# EAGLE board LEDpanelmpsl (EAGLE 6.6.0)
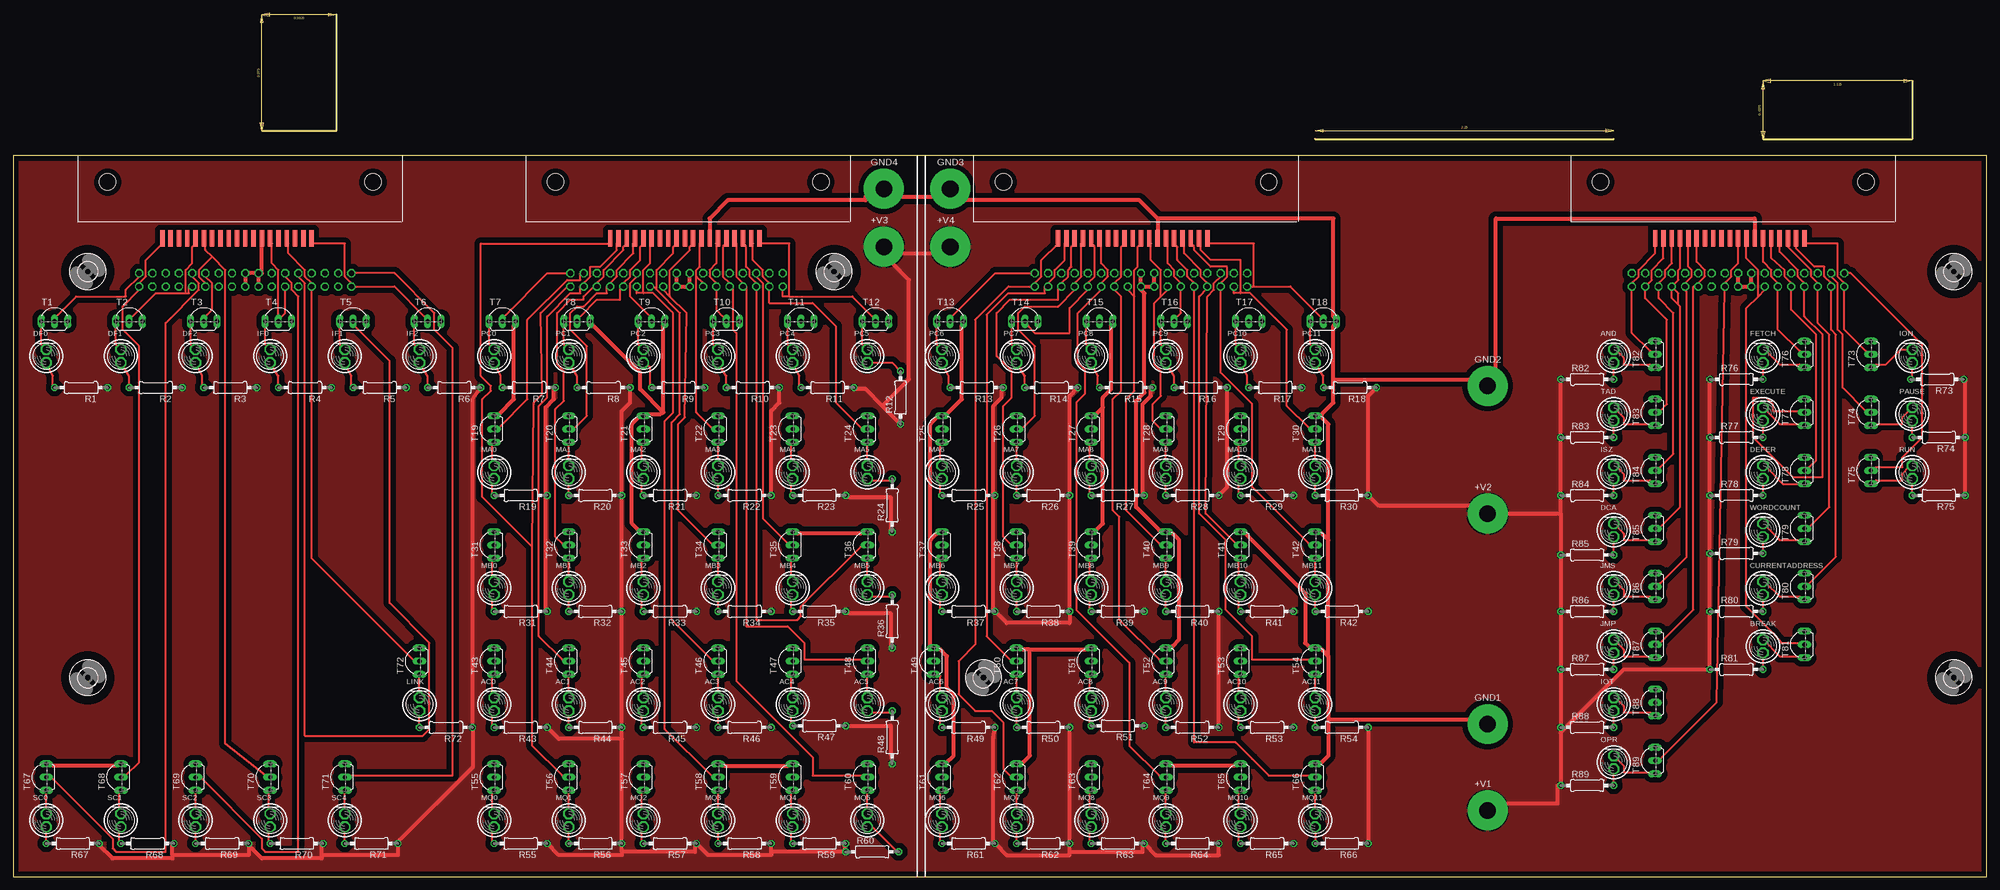
[diagram p2: board, top side]
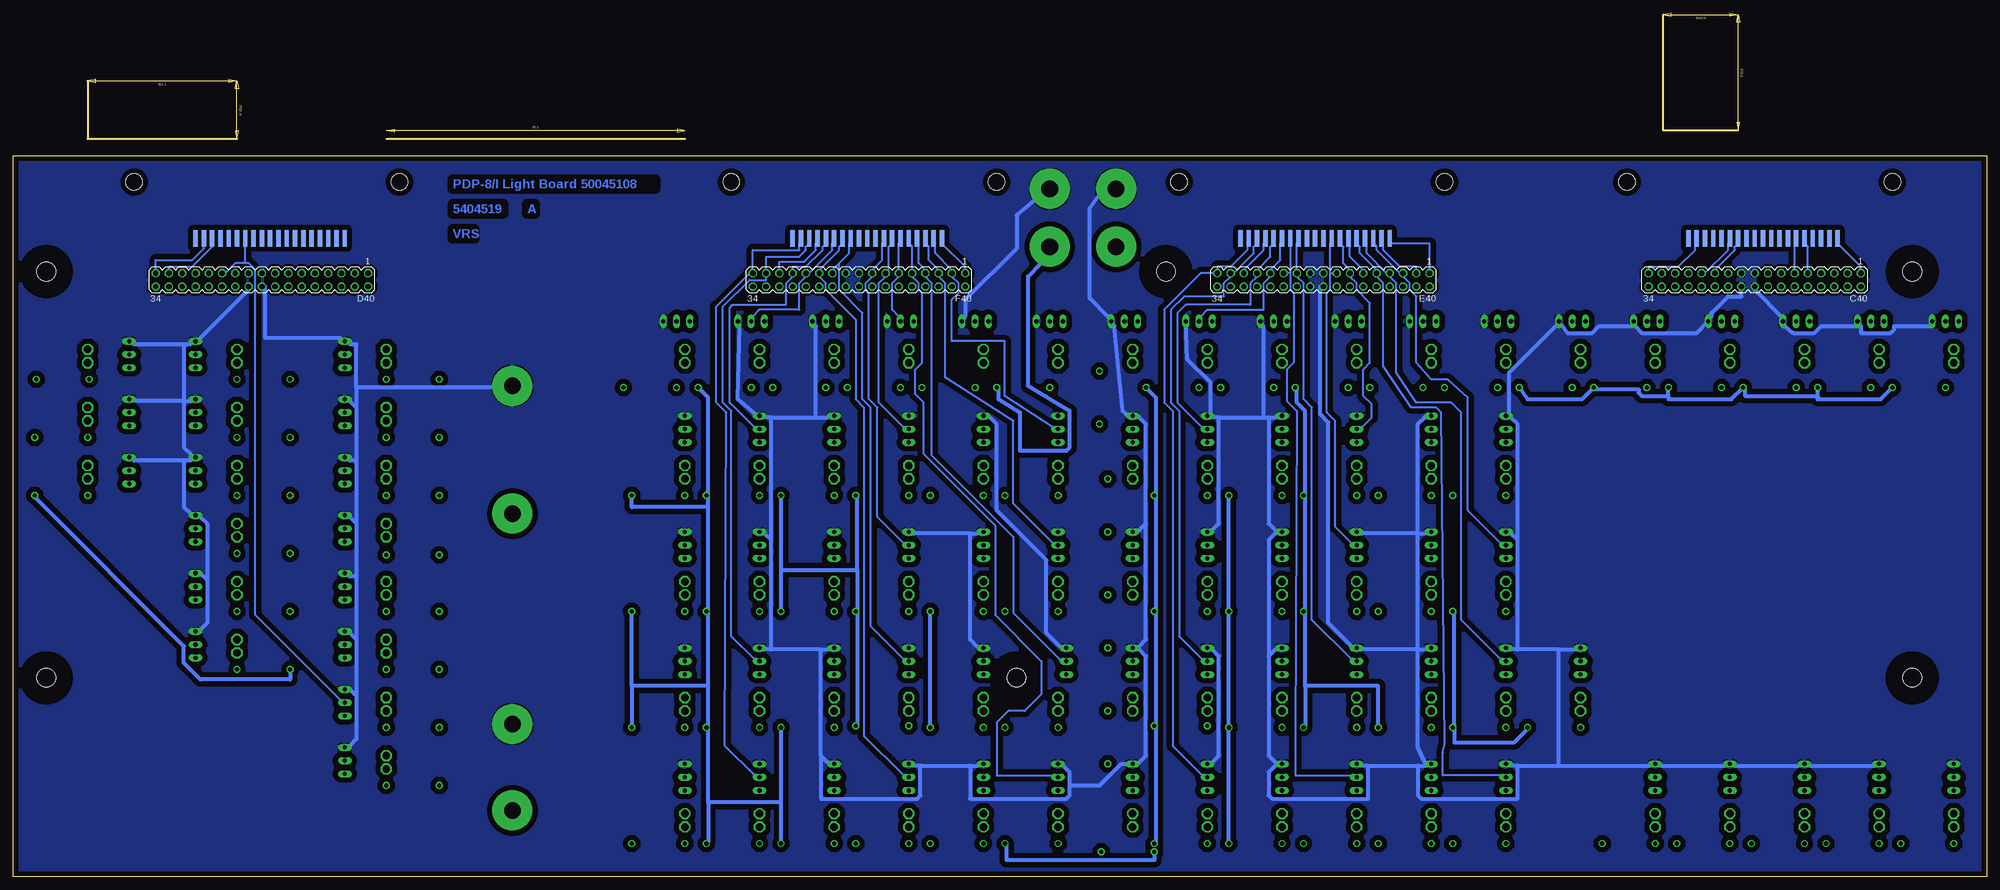
[diagram p3: board, bottom side, seen from below]

Size 377.82 x 165.1 mm. Coordinates in mm from the lower left corner, seen from the top.
Outline: 47.62,142.88 61.91,142.88 61.91,165.1
Outline: 334.96,141.29 363.54,141.29 363.54,152.4
Outline: 249.24,141.29 306.39,141.29
Outline: 377.82,0 377.82,138.11 0,138.11 0,0 377.82,0
Copper layers (1+16): Top 0.035mm / dielectric 1.5mm / Bottom 0.035mm
Design rules "15mils *": minimum track width 15mil, minimum drill 24mil, track to track 15mil, track to pad 10mil, pad to pad 10mil, via to via 10mil, smd to smd 10mil, copper to edge 25mil, drill to drill 10mil, minimum pad ring 10mil, minimum via ring 8mil, stop-mask expansion 0mil, vias tented up to drill 0mil, thermal gap 10mil
Net classes: 1 supply: width 0.762 mm

## Footprints (pad centres in the part's own frame; a part is rotated, then mirrored left to right if it is on the bottom)
SPADELUG = drill 3.175 pad 7.62: 1 0,0
BULB = drill 1.422 octagon: A 0,0; B 0,2.54
MA17-2 = drill 1.016 octagon: 1 -20.32,-1.27; 2 -20.32,1.27; 3 -17.78,-1.27; 4 -17.78,1.27; 5 -15.24,-1.27; 6 -15.24,1.27; 7 -12.7,-1.27; 8 -12.7,1.27; 9 -10.16,-1.27; 10 -10.16,1.27; 11 -7.62,-1.27; 12 -7.62,1.27; 13 -5.08,-1.27; 14 -5.08,1.27; 15 -2.54,-1.27; 16 -2.54,1.27; 17 0,-1.27; 18 0,1.27; 19 2.54,-1.27; 20 2.54,1.27; 21 5.08,-1.27; 22 5.08,1.27; 23 7.62,-1.27; 24 7.62,1.27; 25 10.16,-1.27; 26 10.16,1.27; 27 12.7,-1.27; 28 12.7,1.27; 29 15.24,-1.27; 30 15.24,1.27; 31 17.78,-1.27; 32 17.78,1.27; 33 20.32,-1.27; 34 20.32,1.27
FLEX19 = smd 3.175 x 0.838: 1 0,14.287; 2 0,12.7; 3 0,11.113; 4 0,9.525; 5 0,7.938; 6 0,6.35; 7 0,4.763; 8 0,3.175; 9 0,1.587; 10 0,0; 11 0,-1.587; 12 0,-3.175; 13 0,-4.763; 14 0,-6.35; 15 0,-7.938; 16 0,-9.525; 17 0,-11.113; 18 0,-12.7; 19 0,-14.287
0207/10 = drill 0.813 octagon: 1 -5.08,0; 2 5.08,0
TO92-CBE = drill 0.813 long: B 0,0; C -2.54,0; E 2.54,0
STRAIN-RELIEF = hole 3.175: 7.62,56.515; 7.62,5.715
3,6 = hole 3.6: 0,0

## Placement (x,y rotation side)
+V1  LUG  [SPADELUG]  282.26,12.7 0 top
+V2  LUG  [SPADELUG]  282.26,69.53 0 top
+V3  LUG  [SPADELUG]  166.69,120.65 0 top
+V4  LUG  [SPADELUG]  179.39,120.65 0 top
AC0  [BULB]  92.08,31.75 0 top
AC1  [BULB]  106.36,31.75 0 top
AC2  [BULB]  120.65,31.75 0 top
AC3  [BULB]  134.94,31.75 0 top
AC4  [BULB]  149.22,31.75 0 top
AC5  [BULB]  163.51,31.75 0 top
AC6  [BULB]  177.8,31.75 0 top
AC7  [BULB]  192.09,31.75 0 top
AC8  [BULB]  206.38,31.75 0 top
AC9  [BULB]  220.66,31.75 0 top
AC10  [BULB]  234.95,31.75 0 top
AC11  [BULB]  249.24,31.75 0 top
AND  [BULB]  306.39,98.42 0 top
BREAK  [BULB]  334.96,42.86 0 top
C40  [MA17-2]  44.45,114.3 180 bottom
C40BOT  FLEX19  [FLEX19]  42.86,122.24 90 top
C40TOP  FLEX19  [FLEX19]  42.86,122.24 270 bottom
CURRENTADDRESS  [BULB]  334.96,53.98 0 top
D40  [MA17-2]  330.2,114.3 180 bottom
D40BOT  FLEX19  [FLEX19]  128.59,122.24 90 top
D40TOP  FLEX19  [FLEX19]  128.59,122.24 270 bottom
DCA  [BULB]  306.39,65.09 0 top
DEFER  [BULB]  334.96,76.2 0 top
DF0  [BULB]  6.35,98.42 0 top
DF1  [BULB]  20.64,98.42 0 top
DF2  [BULB]  34.92,98.42 0 top
E40  [MA17-2]  127,114.3 180 bottom
E40BOT  FLEX19  [FLEX19]  214.31,122.24 90 top
E40TOP  FLEX19  [FLEX19]  214.31,122.24 270 bottom
EXECUTE  [BULB]  334.96,87.31 0 top
F40  [MA17-2]  215.9,114.3 180 bottom
F40BOT  FLEX19  [FLEX19]  328.61,122.24 90 top
F40TOP  FLEX19  [FLEX19]  328.61,122.24 270 bottom
FETCH  [BULB]  334.96,98.42 0 top
GND1  LUG  [SPADELUG]  282.26,29.21 0 top
GND2  LUG  [SPADELUG]  282.26,93.98 0 top
GND3  LUG  [SPADELUG]  179.39,131.76 0 top
GND4  LUG  [SPADELUG]  166.69,131.76 0 top
IF0  [BULB]  49.21,98.42 0 top
IF1  [BULB]  63.5,98.42 0 top
IF2  [BULB]  77.79,98.42 0 top
ION  [BULB]  363.54,98.42 0 top
IOT  [BULB]  306.39,31.75 0 top
ISZ  [BULB]  306.39,76.2 0 top
JMP  [BULB]  306.39,42.86 0 top
JMS  [BULB]  306.39,53.98 0 top
LINK  [BULB]  77.79,31.75 0 top
MA0  [BULB]  92.08,76.2 0 top
MA1  [BULB]  106.36,76.2 0 top
MA2  [BULB]  120.65,76.2 0 top
MA3  [BULB]  134.94,76.2 0 top
MA4  [BULB]  149.22,76.2 0 top
MA5  [BULB]  163.51,76.2 0 top
MA6  [BULB]  177.8,76.2 0 top
MA7  [BULB]  192.09,76.2 0 top
MA8  [BULB]  206.38,76.2 0 top
MA9  [BULB]  220.66,76.2 0 top
MA10  [BULB]  234.95,76.2 0 top
MA11  [BULB]  249.24,76.2 0 top
MB0  [BULB]  92.08,53.98 0 top
MB1  [BULB]  106.36,53.98 0 top
MB2  [BULB]  120.65,53.98 0 top
MB3  [BULB]  134.94,53.98 0 top
MB4  [BULB]  149.22,53.98 0 top
MB5  [BULB]  163.51,53.98 0 top
MB6  [BULB]  177.8,53.98 0 top
MB7  [BULB]  192.09,53.98 0 top
MB8  [BULB]  206.38,53.98 0 top
MB9  [BULB]  220.66,53.98 0 top
MB10  [BULB]  234.95,53.98 0 top
MB11  [BULB]  249.24,53.98 0 top
MQ0  [BULB]  92.08,9.53 0 top
MQ1  [BULB]  106.36,9.53 0 top
MQ2  [BULB]  120.65,9.53 0 top
MQ3  [BULB]  134.94,9.53 0 top
MQ4  [BULB]  149.22,9.53 0 top
MQ5  [BULB]  163.51,9.53 0 top
MQ6  [BULB]  177.8,9.53 0 top
MQ7  [BULB]  192.09,9.53 0 top
MQ8  [BULB]  206.38,9.53 0 top
MQ9  [BULB]  220.66,9.53 0 top
MQ10  [BULB]  234.95,9.53 0 top
MQ11  [BULB]  249.24,9.53 0 top
OPR  [BULB]  306.39,20.64 0 top
PAUSE  [BULB]  363.54,87.31 0 top
PC0  [BULB]  92.08,98.42 0 top
PC1  [BULB]  106.36,98.42 0 top
PC2  [BULB]  120.65,98.42 0 top
PC3  [BULB]  134.94,98.42 0 top
PC4  [BULB]  149.22,98.42 0 top
PC5  [BULB]  163.51,98.42 0 top
PC6  [BULB]  177.8,98.42 0 top
PC7  [BULB]  192.09,98.42 0 top
PC8  [BULB]  206.38,98.42 0 top
PC9  [BULB]  220.66,98.42 0 top
PC10  [BULB]  234.95,98.42 0 top
PC11  [BULB]  249.24,98.42 0 top
R1  1.5K  [0207/10]  13.02,93.66 180 top
R2  1.5K  [0207/10]  27.3,93.66 180 top
R3  1.5K  [0207/10]  41.59,93.66 180 top
R4  1.5K  [0207/10]  55.88,93.66 180 top
R5  1.5K  [0207/10]  70.17,93.66 180 top
R6  1.5K  [0207/10]  84.45,93.66 180 top
R7  1.5K  [0207/10]  98.74,93.66 180 top
R8  1.5K  [0207/10]  113.03,93.66 180 top
R9  1.5K  [0207/10]  127.32,93.66 180 top
R10  1.5K  [0207/10]  141.6,93.66 180 top
R11  1.5K  [0207/10]  155.89,93.66 180 top
R12  1.5K  [0207/10]  169.86,91.76 90 top
R13  1.5K  [0207/10]  184.47,93.66 180 top
R14  1.5K  [0207/10]  198.75,93.66 180 top
R15  1.5K  [0207/10]  213.04,93.66 180 top
R16  1.5K  [0207/10]  227.33,93.66 180 top
R17  1.5K  [0207/10]  241.62,93.66 180 top
R18  1.5K  [0207/10]  255.91,93.66 180 top
R19  1.5K  [0207/10]  97.16,73.03 180 top
R20  1.5K  [0207/10]  111.44,73.03 180 top
R21  1.5K  [0207/10]  125.73,73.03 180 top
R22  1.5K  [0207/10]  140.02,73.03 180 top
R23  1.5K  [0207/10]  154.31,73.03 180 top
R24  1.5K  [0207/10]  168.28,71.12 90 top
R25  1.5K  [0207/10]  182.88,73.03 180 top
R26  1.5K  [0207/10]  197.17,73.03 180 top
R27  1.5K  [0207/10]  211.46,73.03 180 top
R28  1.5K  [0207/10]  225.74,73.03 180 top
R29  1.5K  [0207/10]  240.03,73.03 180 top
R30  1.5K  [0207/10]  254.32,73.03 180 top
R31  1.5K  [0207/10]  97.16,50.8 180 top
R32  1.5K  [0207/10]  111.44,50.8 180 top
R33  1.5K  [0207/10]  125.73,50.8 180 top
R34  1.5K  [0207/10]  140.02,50.8 180 top
R35  1.5K  [0207/10]  154.31,50.8 180 top
R36  1.5K  [0207/10]  168.28,48.9 90 top
R37  1.5K  [0207/10]  182.88,50.8 180 top
R38  1.5K  [0207/10]  197.17,50.8 180 top
R39  1.5K  [0207/10]  211.46,50.8 180 top
R40  1.5K  [0207/10]  225.74,50.8 180 top
R41  1.5K  [0207/10]  240.03,50.8 180 top
R42  1.5K  [0207/10]  254.32,50.8 180 top
R43  1.5K  [0207/10]  97.16,28.57 180 top
R44  1.5K  [0207/10]  111.44,28.57 180 top
R45  1.5K  [0207/10]  125.73,28.57 180 top
R46  1.5K  [0207/10]  140.02,28.57 180 top
R47  1.5K  [0207/10]  154.31,28.89 180 top
R48  1.5K  [0207/10]  168.28,26.67 90 top
R49  1.5K  [0207/10]  182.88,28.57 180 top
R50  1.5K  [0207/10]  197.17,28.57 180 top
R51  1.5K  [0207/10]  211.46,28.89 180 top
R52  1.5K  [0207/10]  225.74,28.57 180 top
R53  1.5K  [0207/10]  240.03,28.57 180 top
R54  1.5K  [0207/10]  254.32,28.57 180 top
R55  1.5K  [0207/10]  97.16,6.35 180 top
R56  1.5K  [0207/10]  111.44,6.35 180 top
R57  1.5K  [0207/10]  125.73,6.35 180 top
R58  1.5K  [0207/10]  140.02,6.35 180 top
R59  1.5K  [0207/10]  154.31,6.35 180 top
R60  1.5K  [0207/10]  164.47,4.76 0 top
R61  1.5K  [0207/10]  182.88,6.35 180 top
R62  1.5K  [0207/10]  197.17,6.35 180 top
R63  1.5K  [0207/10]  211.46,6.35 180 top
R64  1.5K  [0207/10]  225.74,6.35 180 top
R65  1.5K  [0207/10]  240.03,6.35 180 top
R66  1.5K  [0207/10]  254.32,6.35 180 top
R67  1.5K  [0207/10]  11.43,6.35 180 top
R68  1.5K  [0207/10]  25.72,6.35 180 top
R69  1.5K  [0207/10]  40.01,6.35 180 top
R70  1.5K  [0207/10]  54.29,6.35 180 top
R71  1.5K  [0207/10]  68.58,6.35 180 top
R72  1.5K  [0207/10]  82.87,28.57 180 top
R73  1.5K  [0207/10]  368.3,95.25 180 top
R74  1.5K  [0207/10]  368.62,84.14 180 top
R75  1.5K  [0207/10]  368.62,73.03 180 top
R76  1.5K  [0207/10]  329.88,95.25 0 top
R77  1.5K  [0207/10]  329.88,84.14 0 top
R78  1.5K  [0207/10]  329.88,73.03 0 top
R79  1.5K  [0207/10]  329.88,61.91 0 top
R80  1.5K  [0207/10]  329.88,50.8 0 top
R81  1.5K  [0207/10]  329.88,39.69 0 top
R82  1.5K  [0207/10]  301.31,95.25 0 top
R83  1.5K  [0207/10]  301.31,84.14 0 top
R84  1.5K  [0207/10]  301.31,73.03 0 top
R85  1.5K  [0207/10]  301.31,61.59 0 top
R86  1.5K  [0207/10]  301.31,50.8 0 top
R87  1.5K  [0207/10]  301.31,39.69 0 top
R88  1.5K  [0207/10]  301.31,28.57 0 top
R89  1.5K  [0207/10]  301.31,17.46 0 top
RUN  [BULB]  363.54,76.2 0 top
SC0  [BULB]  6.35,9.53 0 top
SC1  [BULB]  20.64,9.53 0 top
SC2  [BULB]  34.92,9.53 0 top
SC3  [BULB]  49.21,9.53 0 top
SC4  [BULB]  63.5,9.53 0 top
T1  [TO92-CBE]  7.94,106.36 0 top
T2  [TO92-CBE]  22.23,106.36 0 top
T3  [TO92-CBE]  36.51,106.36 0 top
T4  [TO92-CBE]  50.8,106.36 0 top
T5  [TO92-CBE]  65.09,106.36 0 top
T6  [TO92-CBE]  79.38,106.36 0 top
T7  [TO92-CBE]  93.66,106.36 0 top
T8  [TO92-CBE]  107.95,106.36 0 top
T9  [TO92-CBE]  122.24,106.36 0 top
T10  [TO92-CBE]  136.53,106.36 0 top
T11  [TO92-CBE]  150.81,106.36 0 top
T12  [TO92-CBE]  165.1,106.36 0 top
T13  [TO92-CBE]  179.39,106.36 0 top
T14  [TO92-CBE]  193.68,106.36 0 top
T15  [TO92-CBE]  207.96,106.36 0 top
T16  [TO92-CBE]  222.25,106.36 0 top
T17  [TO92-CBE]  236.54,106.36 0 top
T18  [TO92-CBE]  250.82,106.36 0 top
T19  [TO92-CBE]  92.08,85.72 90 top
T20  [TO92-CBE]  106.36,85.72 90 top
T21  [TO92-CBE]  120.65,85.72 90 top
T22  [TO92-CBE]  134.94,85.72 90 top
T23  [TO92-CBE]  149.22,85.72 90 top
T24  [TO92-CBE]  163.51,85.72 90 top
T25  [TO92-CBE]  177.8,85.72 90 top
T26  [TO92-CBE]  192.09,85.72 90 top
T27  [TO92-CBE]  206.38,85.72 90 top
T28  [TO92-CBE]  220.66,85.72 90 top
T29  [TO92-CBE]  234.95,85.72 90 top
T30  [TO92-CBE]  249.24,85.72 90 top
T31  [TO92-CBE]  92.08,63.5 90 top
T32  [TO92-CBE]  106.36,63.5 90 top
T33  [TO92-CBE]  120.65,63.5 90 top
T34  [TO92-CBE]  134.94,63.5 90 top
T35  [TO92-CBE]  149.22,63.5 90 top
T36  [TO92-CBE]  163.51,63.5 90 top
T37  [TO92-CBE]  177.8,63.5 90 top
T38  [TO92-CBE]  192.09,63.5 90 top
T39  [TO92-CBE]  206.38,63.5 90 top
T40  [TO92-CBE]  220.66,63.5 90 top
T41  [TO92-CBE]  234.95,63.5 90 top
T42  [TO92-CBE]  249.24,63.5 90 top
T43  [TO92-CBE]  92.08,41.27 90 top
T44  [TO92-CBE]  106.36,41.27 90 top
T45  [TO92-CBE]  120.65,41.27 90 top
T46  [TO92-CBE]  134.94,41.27 90 top
T47  [TO92-CBE]  149.22,41.27 90 top
T48  [TO92-CBE]  163.51,41.27 90 top
T49  [TO92-CBE]  176.21,41.27 90 top
T50  [TO92-CBE]  192.09,41.27 90 top
T51  [TO92-CBE]  206.38,41.27 90 top
T52  [TO92-CBE]  220.66,41.27 90 top
T53  [TO92-CBE]  234.95,41.27 90 top
T54  [TO92-CBE]  249.24,41.27 90 top
T55  [TO92-CBE]  92.08,19.05 90 top
T56  [TO92-CBE]  106.36,19.05 90 top
T57  [TO92-CBE]  120.65,19.05 90 top
T58  [TO92-CBE]  134.94,19.05 90 top
T59  [TO92-CBE]  149.22,19.05 90 top
T60  [TO92-CBE]  163.51,19.05 90 top
T61  [TO92-CBE]  177.8,19.05 90 top
T62  [TO92-CBE]  192.09,19.05 90 top
T63  [TO92-CBE]  206.38,19.05 90 top
T64  [TO92-CBE]  220.66,19.05 90 top
T65  [TO92-CBE]  234.95,19.05 90 top
T66  [TO92-CBE]  249.24,19.05 90 top
T67  [TO92-CBE]  6.35,19.05 90 top
T68  [TO92-CBE]  20.64,19.05 90 top
T69  [TO92-CBE]  34.92,19.05 90 top
T70  [TO92-CBE]  49.21,19.05 90 top
T71  [TO92-CBE]  63.5,19.05 90 top
T72  [TO92-CBE]  77.79,41.27 90 top
T73  [TO92-CBE]  355.6,100.01 90 top
T74  [TO92-CBE]  355.6,88.9 90 top
T75  [TO92-CBE]  355.6,77.79 90 top
T76  [TO92-CBE]  342.9,100.01 90 top
T77  [TO92-CBE]  342.9,88.9 90 top
T78  [TO92-CBE]  342.9,77.79 90 top
T79  [TO92-CBE]  342.9,66.67 90 top
T80  [TO92-CBE]  342.9,55.56 90 top
T81  [TO92-CBE]  342.9,44.45 90 top
T82  [TO92-CBE]  314.32,100.01 90 top
T83  [TO92-CBE]  314.32,88.9 90 top
T84  [TO92-CBE]  314.32,77.79 90 top
T85  [TO92-CBE]  314.32,66.67 90 top
T86  [TO92-CBE]  314.32,55.56 90 top
T87  [TO92-CBE]  314.32,44.45 90 top
T88  [TO92-CBE]  314.32,33.34 90 top
T89  [TO92-CBE]  314.32,22.23 90 top
TAD  [BULB]  306.39,87.31 0 top
U$1  [STRAIN-RELIEF]  74.61,125.41 90 top
U$2  [STRAIN-RELIEF]  160.34,125.41 90 top
U$3  [STRAIN-RELIEF]  246.06,125.41 90 top
U$4  [STRAIN-RELIEF]  360.36,125.41 90 top
U$5  [3,6]  371.48,115.89 0 top
U$6  [3,6]  371.48,38.1 0 top
U$7  [3,6]  185.74,38.1 0 top
U$8  [3,6]  14.29,38.1 0 top
U$9  [3,6]  14.29,115.89 0 top
U$11  [3,6]  157.16,115.89 0 top
WORDCOUNT  [BULB]  334.96,65.09 0 top

## Tracks (layer width: path | path; a pad name or v marks a point on that pad's centre or on a via)
+15V
  Top 0.762: 30.48,4.13 30.48,6.03 R68.1 | 30.48,4.13 30.48,3.49 19.05,3.49 16.51,6.03 R67.1 | 45.09,6.03 47.62,3.49 59.05,3.49 59.05,4.13 | 59.05,4.13 59.05,6.03 R70.1 | 30.48,4.13 45.09,4.13 45.09,6.03 | 45.09,6.03 R69.1 | R31.1 101.92,51.12 101.92,72.71 R19.1 101.92,73.34 101.92,89.85 103.5,91.44 103.5,93.34 R7.1 | 59.05,4.13 73.66,4.13 R71.1 73.66,6.67 87.95,20.95 R72.1 87.95,91.44 R6.1 | R12.1 166.37,90.17 | 166.37,90.17 163.19,93.34 161.29,93.34 R11.1 | R23.1 159.7,72.71 167.96,72.71 167.96,66.36 R24.1 | R35.1 159.7,50.48 167.96,50.48 167.96,44.13 R36.1 | R47.1 167.96,28.89 167.96,23.5 R48.1 | R55.1 104.46,4.13 116.52,4.13 116.52,4.76 | 116.52,4.76 R56.1 116.52,26.35 | 116.52,26.35 R44.1 R32.1 R20.1 116.52,89.22 118.11,90.81 R8.1 | 159.07,4.76 159.07,6.03 R59.1 | 145.1,4.76 R58.1 | 145.1,4.76 145.1,4.13 133.03,4.13 R57.1 130.49,6.03 130.49,4.76 116.52,4.76 | R22.1 145.1,89.22 146.69,90.81 R10.1 | 159.07,4.76 145.1,4.76 | 159.07,4.76 R60.1 | R43.1 104.46,26.35 116.52,26.35 | R13.1 189.23,93.34 189.23,91.76 187.64,90.17 187.64,73.34 R25.1 187.64,72.71 187.64,51.12 R37.1 190.18,48.58 202.25,48.58 R38.1 R26.1 202.25,92.08 R14.1 | R49.1 187.64,26.67 187.64,6.67 R61.1 190.18,4.13 202.25,4.13 202.25,4.76 | R50.1 R62.1 202.25,4.76 | R54.1 R66.1 | R15.1 217.81,93.34 217.81,92.08 216.22,90.49 216.22,73.34 R27.1 | R64.1 230.82,4.13 218.76,4.13 R63.1 216.22,6.03 216.22,4.76 202.25,4.76 | R52.1 R40.1 | R28.1 232.41,74.61 R16.1 | R75.1 R74.1 373.7,94.93 R73.1 | R76.1 R77.1 R78.1 R79.1 R80.1 R81.1 308.29,39.69 296.23,27.62 | R18.1 259.4,92.08 R30.1 261.3,71.12 278.76,71.12 +V2.1 296.23,69.53 | R82.1 R83.1 R84.1 296.23,69.53
  Top 0.762: 296.23,27.62 R88.1 R87.1 R86.1 R85.1 296.23,69.53 | 296.23,27.62 R89.1 295.59,17.46 295.59,13.97 285.75,13.97 +V1.1 | +V4.1 175.9,119.38 | 166.37,90.17 171.45,95.25 171.45,114.3 168.28,117.47 +V3.1 170.18,119.38 175.58,119.38
  Bottom 0.762: R6.1 87.95,91.44 77.47,91.44 R5.1 74.93,93.34 66.67,93.34 66.67,92.71 66.04,92.08 60.96,92.08 | R1.1 20.32,91.44 32.38,91.44 32.38,92.08 | 32.38,92.08 R2.1 | 60.96,92.08 R4.1 | 60.96,92.08 60.96,91.44 48.9,91.44 R3.1 46.35,93.34 46.35,92.08 32.38,92.08 | R31.1 101.92,50.48 101.92,28.89 R43.1 101.92,28.26 101.92,25.72 90.49,25.72 87.95,28.26 R72.1 | 159.07,28.89 159.07,50.48 R35.1 159.07,51.12 159.07,72.71 R23.1 159.07,73.34 159.07,91.76 R11.1 160.66,93.98 | 130.49,36.51 130.49,50.48 R33.1 130.49,51.12 130.49,72.71 R21.1 130.49,73.34 130.49,89.22 132.08,90.81 132.08,93.34 R9.1 | 130.49,36.51 130.49,28.89 R45.1 | 130.49,36.51 116.52,36.51 R44.1 | R58.1 R46.1 R34.1 R22.1 | 159.07,28.89 159.07,6.67 R59.1 | 159.07,28.89 R47.1 | +V4.1 180.97,117.47 183.51,114.94 183.51,93.98 175.58,89.22 175.58,82.23 176.21,81.6 185.1,81.6 185.1,88.9 189.23,91.44 189.23,93.34 R13.1 | R50.1 R38.1 | 259.4,36.51 R54.1 | 259.4,36.51 R42.1 | 244.79,14.29 244.79,28.26 R53.1 244.79,28.89 244.79,36.51 | 244.79,14.29 244.79,6.67 R65.1 | 244.79,36.51 244.79,50.48 R41.1 244.79,51.12 244.79,70.8 | 244.79,70.8 244.79,72.71 R29.1 244.79,73.34 244.79,91.76 R17.1 | 244.79,36.51 259.4,36.51 | R51.1 216.22,28.89 216.22,50.48 R39.1 216.22,51.12 216.22,58.74 | 216.22,58.74 216.22,72.71 R27.1 | R64.1 230.82,14.29 | 230.82,14.29 R52.1 | R40.1 230.82,58.74 | 230.82,58.74 R28.1 | 230.82,58.74 216.22,58.74 | 230.82,14.29 244.79,14.29 | R81.1 324.8,37.78 341.95,37.78 345.12,40.96 345.12,44.13 373.7,72.71 R75.1 | 244.79,70.8 259.4,70.8 R30.1 | R60.1 159.38,3.17 187.64,3.17 187.64,6.03 | 187.64,6.03 187.64,6.35 | 187.64,6.03 R61.1
  pour Top (isolate 1.016): 0,0 377.82,0 377.82,138.11 0,138.11
AC0
  Bottom 0.381: T43.B 93.03,41.59 100.65,49.21 100.65,88.9 102.55,90.81 109.22,90.81 113.03,96.52 113.03,113.67 114.3,114.94 E40.7 114.94,115.57 118.75,119.38 118.75,121.28 D40TOP.4
AC1
  Top 0.381: T44.B 105.09,41.59 100.65,46.04 100.65,90.17 102.23,91.76 102.23,107.31 106.68,111.76 108.58,111.76 108.58,113.03 E40.4 109.22,113.67 110.49,114.94 110.49,116.84 112.39,116.84 115.57,120.02 115.57,121.28 D40BOT.2
AC2
  Bottom 0.381: D40TOP.12 132.08,121.28 E40.21 132.08,114.94 130.81,113.67 130.81,91.44 129.22,89.85 129.22,49.21 121.6,41.59 T45.B
AC3
  Top 0.381: 123.19,112.39 122.56,113.03 E40.14 | 123.19,112.39 127.64,107.95 127.64,88.58 126.05,87 126.05,49.21 133.67,41.59 T46.B | 123.19,112.39 123.19,116.2 126.36,119.38 126.36,120.65 127,121.28 D40BOT.9
AC4
  Bottom 0.381: D40TOP.17 139.7,121.28 140.34,120.65 140.34,119.38 144.15,115.57 E40.31 144.78,114.94 146.05,113.67 146.05,111.12 153.67,111.12 156.21,108.58 156.21,90.81 154.62,89.22 154.62,46.04 150.18,41.59 T47.B
AC5
  Top 0.381: T48.B 162.24,41.59 151.45,41.59 151.45,44.77 148.27,47.94 140.34,47.94 140.34,113.03 E40.28 139.7,113.67 138.43,114.94 138.43,121.28 D40BOT.16
AC6
  Bottom 0.381: E40TOP.4 204.47,121.28 204.47,117.47 203.2,116.2 F40.7 203.2,114.94 201.93,113.67 201.93,80.64 186.37,65.09 186.37,50.48 177.48,41.59 T49.B
AC7
  Top 0.381: T50.B 190.82,41.59 186.37,46.04 186.37,107.63 190.5,111.76 197.49,111.76 197.49,113.03 F40.4 198.12,113.67 199.39,114.94 199.39,116.2 201.29,118.11 201.29,121.28 E40BOT.2
AC8
  Bottom 0.381: 219.71,117.47 220.98,116.2 F40.21 | 219.71,117.47 217.81,119.38 217.81,121.28 E40TOP.12 | 219.71,117.47 219.71,112.39 215.26,107.95 215.26,91.44 213.68,89.85 213.68,47.94 207.33,41.59 T51.B
AC9
  Top 0.381: T52.B 219.39,41.59 211.77,49.21 211.77,68.9 210.5,70.17 210.5,91.44 212.09,93.03 212.09,111.12 210.82,112.39 F40.14 210.82,113.67 212.09,114.94 212.09,120.65 212.72,121.28 E40BOT.9
AC10
  Bottom 0.381: T53.B 235.9,41.59 240.35,46.04 240.35,89.22 241.94,90.81 241.94,109.22 236.85,114.3 233.68,114.3 F40.31 233.68,118.75 227.33,118.75 226.06,120.02 226.06,120.65 225.43,121.28 E40TOP.17
AC11
  Top 0.381: T54.B 247.97,41.59 237.17,41.59 237.17,46.04 232.09,51.12 232.09,64.45 227.01,69.53 227.01,111.12 228.6,112.71 F40.28 228.6,113.67 227.33,114.94 227.33,116.2 224.16,119.38 224.16,121.28 E40BOT.16
AND
  Top 0.381: T82.B 313.37,100.65 309.88,104.14 D40.2 309.88,113.67 311.15,114.94 311.15,116.2 314.32,119.38 F40BOT.1
BREAK
  Top 0.381: 334.01,111.12 335.28,112.39 D40.22 | 334.01,111.12 331.79,108.9 331.79,51.75 336.87,46.67 338.45,44.77 341.95,44.77 T81.B | 334.01,111.12 334.01,116.2 331.79,118.43 331.79,121.6 F40BOT.12
CA
  Top 0.381: T80.B 343.85,56.2 348.93,61.28 348.93,103.82 347.98,104.78 D40.32 347.98,113.67 346.71,114.94 346.71,116.84 344.81,116.84 341.31,120.33 341.31,121.6 F40BOT.18
DCA
  Top 0.381: 318.77,109.54 317.5,110.81 D40.8 | 318.77,109.54 319.09,109.22 319.09,70.8 315.28,66.99 T85.B | 318.77,109.54 318.77,111.76 D40.8 | D40.8 318.77,114.3 318.77,116.2 319.09,116.52 F40BOT.4
DEFER
  Top 0.381: T78.B 343.85,78.42 345.12,79.69 345.12,103.82 340.36,108.58 D40.26 340.36,113.67 339.09,114.94 339.09,116.2 336.55,118.43 336.55,120.97 336.55,121.28 F40BOT.15
DF0
  Top 0.381: T1.B 8.26,107.31 12.06,111.12 21.59,111.12 21.59,112.39 24.13,114.94 C40.1
  Bottom 0.381: C40TOP.1 28.57,121.28 24.13,116.84 24.13,116.2 C40.1
DF1
  Top 0.381: 33.02,111.76 33.66,111.76 33.66,113.03 C40.10 | 33.02,111.76 27.3,111.76 22.86,107.31 T2.B | 33.02,111.76 33.02,116.2 34.29,117.47 34.29,120.65 34.92,121.28 C40BOT.5
DF2
  Top 0.381: T3.B 36.83,107.31 38.1,108.58 38.1,113.67 36.83,114.94 C40.11
  Bottom 0.381: C40TOP.6 36.83,121.28 36.83,116.2 C40.11
EXECUTE
  Top 0.381: T77.B 341.95,89.22 336.87,89.22 336.87,90.49 335.6,91.76 333.06,91.76 333.06,84.14 340.68,76.52 346.39,76.52 346.39,103.82 342.9,107.31 D40.28 342.9,113.67 341.63,114.94 341.63,116.2 338.14,119.7 338.14,121.6 F40BOT.16
FETCH
  Top 0.381: T76.B 341.95,100.65 337.82,104.78 D40.24 337.82,113.67 336.55,114.94 336.55,116.2 334.96,117.79 334.96,121.6 F40BOT.14
GND
  Top 0.762: D40BOT.13 133.35,126.05 136.84,129.54 163.19,129.54 163.19,130.18 GND4.1 170.18,130.18 175.9,130.18 GND3.1 182.25,129.54 215.58,129.54 219.07,126.05 | T58.E 136.21,21.27 148.27,21.27 T59.E | T35.E 150.18,65.72 162.24,65.72 T36.E | 124.46,88.9 124.46,105.41 T9.E | 124.46,88.9 123.83,88.58 121.6,88.58 T21.E 119.7,87.95 118.43,86.68 118.43,67.63 119.7,66.36 T33.E | 124.46,88.9 120.02,93.34 120.02,96.52 111.12,105.41 T8.E | E40.17 E40.18 E40.20 E40.19 | T67.E 7.62,21.27 19.68,21.27 T68.E | C40.20 C40.19 | C40BOT.13 47.62,115.57 C40.19 | C40.18 C40.17 C40.19 | T19.E 93.03,88.58 95.89,91.44 95.89,105.41 T7.E | D40.17 D40.18 D40.20 D40.19 | T13.E 181.61,105.41 181.61,91.44 178.75,88.58 T25.E 176.85,87.95 175.58,86.68 175.58,64.45 | T61.E 178.75,21.91 180.02,23.18 180.02,34.92 178.75,36.2 178.75,42.23 177.48,43.5 T49.E 175.58,44.13 175.58,64.45 | 175.58,64.45 176.85,65.72 T37.E | 194.63,43.5 205.42,43.5 T51.E | 194.63,43.5 193.36,43.5 T50.E | 194.63,43.5 194.63,23.18 193.36,21.91 T62.E | 208.6,89.85 207.33,88.58 T27.E | 208.6,89.85 208.6,91.76 210.19,93.34 210.19,105.41 T15.E | 208.6,89.85 208.6,67.63 207.33,66.36 T39.E | T64.E 221.93,21.27 234,21.27 T65.E | F40.18 F40.20 F40.19 | F40.18 F40.17 | T52.E 221.93,44.13 223.2,45.4 223.2,64.45 221.93,65.72 T40.E 219.39,66.36 214.95,70.8 214.95,91.12 216.53,92.71 216.53,111.76 215.9,112.39 F40.18 | F40BOT.13 333.38,126.05 283.85,126.05 283.85,97.16 GND2.1 278.76,95.25 252.73,95.25 | 219.07,126.05 E40BOT.13 | 252.73,95.25 252.73,105.41 T18.E 252.73,107.31 252.73,126.05 219.07,126.05 | 252.73,95.25 252.73,90.81 250.51,88.58 T30.E 250.51,87.95 251.78,86.68 251.78,64.45
  Top 0.762: 251.78,42.23 251.78,30.16 | 251.78,30.16 251.78,23.18 250.51,21.91 T66.E | 251.78,42.23 250.51,43.5 T54.E 247.97,44.13 247.33,44.77 247.33,54.29 235.9,65.72 T41.E | 251.78,64.45 250.51,65.72 T42.E | 251.78,42.23 251.78,64.45 | 251.78,30.16 278.76,30.16 GND1.1
  Bottom 0.762: 137.48,42.23 136.21,43.5 T46.E | 137.48,42.23 137.48,23.18 136.21,21.91 T58.E 136.21,21.27 137.48,20 137.48,15.56 136.84,14.92 118.43,14.92 118.43,21.27 | 137.48,42.23 137.48,64.45 136.21,65.72 T34.E 136.21,66.36 137.48,67.63 137.48,87.95 | T47.E 148.27,43.5 147,42.23 147,23.18 148.27,21.91 T59.E | 147,87.95 148.27,87.95 | 147,87.95 138.43,87.95 | 138.43,87.95 136.21,87.95 T22.E | 148.27,87.95 T23.E | 138.43,87.95 138.43,105.41 T10.E | 148.27,87.95 148.59,87.95 148.59,94.61 153.03,99.06 T11.E | 147,87.95 147,67.63 148.27,66.36 T35.E | 160.97,67.63 160.97,86.68 162.24,87.95 T24.E 164.78,88.58 165.42,89.22 167,105.41 T12.E 168.28,107.31 171.77,110.81 171.77,127.95 170.18,130.18 GND4.1 | 160.97,67.63 162.24,66.36 T36.E | 160.97,67.63 160.97,45.4 162.24,44.13 T48.E 162.24,43.5 160.97,42.23 160.97,23.18 162.24,21.91 T60.E 165.74,21.59 169.86,17.46 175.58,17.46 | 108.9,65.72 119.7,65.72 T33.E | 108.9,65.72 107.63,65.72 T32.E | 108.9,65.72 108.9,86.68 107.63,87.95 T20.E | 118.43,21.27 119.7,21.27 T57.E | 118.43,21.27 108.9,21.27 | 108.9,21.27 107.63,21.27 T56.E 107.63,21.91 108.9,24.77 108.9,43.5 | 108.9,43.5 119.7,43.5 T45.E 121.6,44.13 126.05,48.58 126.05,87 127.64,88.58 127.64,113.03 E40.18 | 108.9,43.5 107.63,43.5 T44.E | 108.9,43.5 108.9,65.72 | T68.E 21.59,21.27 33.66,21.27 T69.E 36.2,21.27 48.26,21.27 T70.E 50.16,21.27 62.23,21.27 T71.E 64.77,21.27 81.92,21.27 | 89.85,21.27 81.92,21.27 | 89.85,21.27 91.12,21.27 T55.E | C40.20 46.99,111.12 49.53,111.12 52.7,107.95 52.7,107.31 T4.E 55.56,104.14 66.04,104.14 67.31,105.41 T5.E 67.94,105.41 74.3,105.41 75.56,104.14 80.33,104.14 81.28,105.41 T6.E 82.55,105.41 91.44,96.52 91.44,88.27 T19.E 91.12,87.95 89.85,86.68 89.85,64.45
  Bottom 0.762: T1.E 10.79,105.41 17.78,105.41 17.78,104.78 18.41,104.14 24.13,104.14 24.13,105.41 T2.E 25.4,105.41 31.75,105.41 33.02,104.14 37.15,104.14 38.73,105.41 T3.E 39.37,107.31 44.45,112.39 C40.18 | 89.85,43.5 91.12,43.5 T43.E | 81.92,43.5 89.85,43.5 | 81.92,43.5 79.06,43.5 T72.E | 89.85,64.45 91.12,65.72 T31.E | 89.85,43.5 89.85,64.45 | 81.92,21.27 81.92,43.5 | 108.9,21.27 108.9,15.56 108.27,14.92 89.85,14.92 89.85,21.27 | 312.1,34.61 312.1,26.35 313.37,25.08 T89.E | 312.1,34.61 313.37,35.88 T88.E | 312.1,45.4 313.37,46.67 T87.E | 312.1,45.4 312.1,34.61 | 312.1,57.47 313.37,57.47 T86.E | 312.1,57.47 312.1,45.4 | 312.1,67.63 313.37,68.9 T85.E | 312.1,67.63 312.1,57.47 | 312.1,79.69 313.37,79.69 T84.E | 312.1,79.69 312.1,67.63 | 312.1,89.85 313.37,91.12 T83.E | 312.1,89.85 312.1,79.69 | 312.1,93.66 312.1,89.85 | 312.1,93.66 312.1,101.92 313.37,101.92 T82.E 315.28,103.19 329.56,103.19 329.56,113.03 D40.18 | 345.12,101.92 354.65,101.92 T73.E | 345.12,101.92 343.85,101.92 T76.E 341.95,103.19 332.74,112.39 D40.20 | 340.68,56.83 340.68,48.58 341.95,47.31 T81.E | 340.68,56.83 341.95,58.1 T80.E | 340.68,56.83 340.68,67.63 341.95,68.9 T79.E 343.85,69.53 345.12,70.8 345.12,79.69 | 345.12,79.69 354.65,79.69 T75.E | 345.12,79.69 343.85,79.69 T78.E 343.85,80.96 345.12,82.23 345.12,91.12 | 345.12,91.12 354.65,91.12 T74.E | 345.12,91.12 343.85,91.12 T77.E | 345.12,101.92 345.12,91.12 | T26.E 190.82,87.95 189.55,86.68 189.55,70.17 180.02,60.64 180.02,46.67 177.48,44.13 T49.E | 204.15,21.27 205.42,21.27 T63.E | 204.15,21.27 194.63,21.27 | 194.63,21.27 193.36,21.27 T62.E | 194.63,65.72 205.42,65.72 T39.E | 194.63,65.72 193.36,65.72 T38.E
  Bottom 0.762: 194.63,65.72 194.63,45.4 193.36,44.13 T50.E | 175.58,17.46 175.58,15.56 176.21,14.92 194.63,14.92 194.63,21.27 | 175.58,17.46 175.58,20 176.85,21.27 T61.E | 232.73,87.95 234,87.95 | 232.73,87.95 224.16,87.95 | 224.16,87.95 221.93,87.95 T28.E | 234,87.95 T29.E | 224.16,87.95 224.16,105.41 T16.E | 234,87.95 234.95,87.95 239.08,91.44 238.76,105.41 T17.E | 232.73,43.5 234,43.5 T53.E | 223.2,43.5 232.73,43.5 | 223.2,43.5 221.93,43.5 T52.E | 232.73,64.45 234,65.72 T41.E | 232.73,43.5 232.73,64.45 | 223.2,23.18 221.93,21.91 T64.E | 223.2,23.18 223.2,43.5 | 232.73,64.45 232.73,87.95 | 204.15,21.27 204.15,15.56 204.79,14.92 223.2,14.92 223.2,23.18 | 312.1,93.66 285.12,93.66 GND2.1 | T14.E 195.58,107.31 195.58,110.49 185.74,120.33 185.74,126.68 182.25,129.54 GND3.1
  pour Bottom (isolate 1.016): 0,0 377.82,0 377.82,138.11 0,138.11
IF0
  Top 0.381: C40.24 52.07,112.39 52.07,107.95 51.44,107.31 T4.B 50.8,107.31 50.8,116.2 49.53,117.47 49.53,121.28 C40BOT.14
IF1
  Top 0.381: T5.B 65.41,105.41 72.07,98.74 72.07,52.39 79.69,44.77 79.69,28.26 78.42,26.99 55.88,26.99 55.88,113.67 54.61,114.94 C40.25
  Bottom 0.381: C40TOP.14 49.53,121.28 49.53,120.02 53.98,115.57 C40.25
IF2
  Top 0.381: T6.B 78.74,107.31 73.03,113.03 65.41,113.03 C40.34 64.77,113.67 63.5,114.94 63.5,121.28 57.15,121.28 C40BOT.19
ION
  Top 0.381: T73.B 354.65,100.65 350.52,104.78 D40.34 350.52,113.67 349.25,114.94 349.25,121.28 342.9,121.28 F40BOT.19
IOT
  Bottom 0.381: 332.74,117.47 333.38,117.47 333.38,120.65 F40TOP.13 | 332.74,117.47 331.47,116.2 331.47,50.16 315.28,33.97 T88.B | 332.74,117.47 335.28,117.47 337.19,115.57 D40.23
ISZ
  Top 0.381: F40BOT.3 317.5,117.47 316.23,116.2 316.23,114.94 314.96,113.67 D40.6 314.96,110.81 317.82,107.95 317.82,80.96 315.28,78.42 T84.B
JMP
  Top 0.381: F40BOT.6 322.26,121.6 322.26,117.79 323.85,116.2 323.85,114.94 322.58,113.67 D40.12 321.63,113.03 321.63,51.12 315.28,44.77 T87.B
JMS
  Top 0.381: F40BOT.5 320.68,116.84 321.31,116.2 321.31,114.94 320.04,113.67 D40.10 320.04,112.39 320.36,112.08 320.36,61.28 315.28,56.2 T86.B
LINK
  Top 0.381: T72.B 76.52,41.59 57.15,60.96 C40.28 57.15,113.67 55.88,114.94 55.88,116.2 52.7,119.38 52.7,121.28 C40BOT.16
MA0
  Top 0.381: T19.B 93.03,86.04 98.42,91.44 98.42,106.68 106.05,114.3 108.58,114.3 108.58,115.57 E40.3
  Bottom 0.381: D40TOP.2 115.57,121.28 115.57,120.02 112.39,116.84 109.22,116.84 E40.3
MA1
  Top 0.381: T20.B 107.63,86.04 109.86,88.27 109.86,101.6 106.68,104.78 106.68,107.95 107.95,109.22 109.22,109.22 111.76,111.76 113.67,111.76 113.67,113.03 E40.8 114.3,113.67 115.57,114.94 115.57,116.2 118.75,119.38 118.75,121.28 D40BOT.4
MA2
  Bottom 0.381: T21.B 119.7,86.04 117.79,87.95 117.79,90.49 119.38,92.08 119.38,97.16 118.11,98.42 118.11,109.86 120.65,112.39 120.65,113.67 121.92,114.94 E40.13 121.92,116.2 123.19,117.47 123.19,120.65 123.83,121.28 D40TOP.7
MA3
  Top 0.381: 130.81,114.94 130.81,116.2 131.44,116.84 131.44,121.28 D40BOT.12 | 130.81,114.94 132.08,113.67 E40.22 | 130.81,114.94 130.81,88.9 133.67,86.04 T22.B
MA4
  Bottom 0.381: D40TOP.15 136.53,121.28 137.16,120.65 137.16,118.75 139.7,116.2 E40.27 139.7,114.94 140.97,113.67 140.97,109.54 153.35,109.54 154.94,107.95 154.94,90.81 150.18,86.04 T23.B
MA5
  Top 0.381: T24.B 162.24,86.04 157.48,90.81 157.48,105.41 153.03,109.86 144.78,109.86 E40.32 144.78,113.67 143.51,114.94 143.51,116.2 141.6,118.11 141.6,121.28 D40BOT.18
MA6
  Bottom 0.381: T25.B 178.75,86.04 187.96,92.08 187.96,102.55 198.12,102.55 198.12,110.49 196.85,111.76 196.85,113.67 198.12,114.94 F40.3 198.12,116.2 201.29,119.38 201.29,121.28 E40TOP.2
MA7
  Top 0.381: E40BOT.4 204.47,121.28 204.47,114.94 203.2,113.67 F40.8 203.2,112.39 200.03,109.22 193.68,109.22 192.41,107.95 192.41,104.78 195.58,101.6 195.58,88.27 193.36,86.04 T26.B
MA8
  Bottom 0.381: T27.B 207.33,86.04 212.09,90.81 212.09,113.67 210.82,114.94 F40.13 210.19,115.57 210.19,120.65 209.55,121.28 E40TOP.7
MA9
  Top 0.381: 219.71,111.12 220.98,112.39 F40.22 | 219.71,111.12 218.44,109.86 218.44,98.11 219.71,96.84 219.71,92.08 218.12,90.49 218.12,87.31 219.39,86.04 T28.B | 219.71,111.12 219.71,116.2 217.81,118.11 217.81,121.28 E40BOT.12
MA10
  Bottom 0.381: T29.B 235.9,86.04 240.66,90.81 240.66,108.9 240.03,109.54 229.87,109.54 229.87,113.67 228.6,114.94 F40.27 228.6,116.84 226.06,116.84 222.88,120.02 222.88,120.65 222.25,121.28 E40TOP.15
MA11
  Top 0.381: 234.95,111.76 233.68,111.76 F40.32 | 234.95,111.76 236.85,111.76 243.84,104.78 243.84,90.17 247.97,86.04 T30.B | 234.95,111.76 234.95,118.11 229.24,118.11 227.33,120.02 227.33,121.28 E40BOT.18
MB0
  Bottom 0.381: T31.B 93.03,63.82 99.38,70.17 99.38,91.76 103.19,95.25 106.36,95.25 109.22,98.42 109.22,111.12 110.49,112.39 110.49,113.67 111.76,114.94 E40.5 112.39,115.57 116.84,120.02 116.84,120.65 117.47,121.28 D40TOP.3
MB1
  Top 0.381: T32.B 105.09,63.82 103.82,65.09 103.82,89.53 105.41,91.12 105.41,96.84 104.14,98.11 104.14,107.95 106.68,110.49 109.22,110.49 109.22,111.12 111.12,113.03 E40.6 111.76,113.67 113.03,114.94 113.03,116.2 116.84,120.02 116.84,120.65 117.47,121.28 D40BOT.3
MB2
  Bottom 0.381: 125.73,115.57 125.73,121.28 D40TOP.8 | 125.73,115.57 125.73,112.39 126.36,111.76 126.36,88.9 124.78,87.31 124.78,66.99 121.6,63.82 T33.B | 125.73,115.57 E40.15
MB3
  Top 0.381: 125.73,111.12 124.46,112.39 E40.16 | 125.73,111.12 128.91,107.95 128.59,87.95 127.32,86.68 127.32,70.17 133.67,63.82 T34.B | 125.73,111.12 125.73,116.2 129.54,120.02 129.54,120.65 130.18,121.28 D40BOT.11
MB4
  Top 0.381: T35.B 148.27,63.82 143.51,68.58 143.51,113.67 142.24,114.94 E40.29
  Bottom 0.381: D40TOP.16 138.43,121.28 138.43,120.02 142.24,116.2 E40.29
MB5
  Top 0.381: T36.B 162.24,63.18 150.81,51.75 150.81,49.85 150.18,49.21 142.24,49.21 E40.30 142.24,113.67 140.97,114.94 140.97,116.2 140.34,116.84 140.34,120.65 139.7,121.28 D40BOT.17
MB6
  Bottom 0.381: T37.B 178.75,63.82 186.37,71.44 186.37,87.31 199.39,95.57 199.39,113.67 200.66,114.94 F40.5 200.66,116.2 202.56,118.11 202.56,120.65 203.2,121.28 E40TOP.3
MB7
  Top 0.381: E40BOT.3 203.2,121.28 202.56,120.65 202.56,116.84 201.93,116.2 201.93,114.94 200.66,113.67 F40.6 200.03,113.03 200.03,110.49 190.82,110.49 188.28,107.95 188.28,99.69 191.13,96.84 191.13,91.76 189.55,90.17 189.55,65.09 190.82,63.82 T38.B
MB8
  Bottom 0.381: E40TOP.8 211.46,121.28 211.46,118.11 213.36,116.2 F40.15 213.36,114.94 214.63,113.67 214.63,112.39 214,111.76 214,91.44 212.41,89.85 212.41,68.9 207.33,63.82 T39.B
MB9
  Top 0.381: 214.63,111.12 214.63,93.03 213.04,91.44 213.04,70.17 219.39,63.82 T40.B | 214.63,111.12 213.36,112.39 F40.16 | 214.63,111.12 214.63,116.2 215.26,116.84 215.26,120.65 215.9,121.28 E40BOT.11
MB10
  Top 0.381: T41.B 234,63.82 228.28,69.53 228.6,111.12 229.87,112.39 229.87,113.67 231.14,114.94 F40.29
  Bottom 0.381: F40.29 231.14,117.79 226.38,117.79 224.16,120.02 224.16,121.28 E40TOP.16
MB11
  Top 0.381: E40BOT.17 225.43,121.28 226.06,120.65 226.06,120.02 229.24,116.84 232.41,116.84 232.41,114.94 231.14,113.67 F40.30 231.14,96.52 237.17,90.49 237.17,74.61 247.97,63.82 T42.B
MQ0
  Bottom 0.381: T55.B 93.03,19.37 104.14,19.37 104.14,23.81 103.82,25.4 104.46,88.9 105.41,89.85 110.17,89.85 115.57,97.79 115.57,113.67 116.84,114.94 E40.9 116.84,116.2 120.02,119.38 120.02,120.65 120.65,121.28 D40TOP.5
MQ1
  Top 0.381: 99.38,63.18 99.69,90.49 99.69,90.81 101.28,92.39 100.97,107.95 106.05,113.03 E40.2 | 99.38,63.18 99.38,25.08 105.09,19.37 T56.B | 99.38,63.18 89.85,72.71 89.85,91.44 91.44,93.03 91.44,93.98 89.53,95.89 89.53,121.28 114.3,121.28 D40BOT.1
MQ2
  Bottom 0.381: D40TOP.13 133.35,115.57 | 133.35,115.57 133.35,112.39 132.72,111.76 132.72,98.42 133.99,97.16 133.99,91.12 132.08,89.22 132.4,26.04 132.4,19.37 121.6,19.37 T57.B | 133.35,115.57 E40.23
MQ3
  Top 0.381: 120.65,111.76 119.38,111.76 E40.12 | 120.65,111.76 122.56,111.76 126.36,107.95 126.36,88.9 124.78,87.31 124.78,28.26 133.67,19.37 T58.B | 120.65,111.76 120.65,116.2 121.92,117.47 121.92,121.28 D40BOT.6
MQ4
  Bottom 0.381: T59.B 150.18,19.37 155.89,25.08 155.89,89.22 157.48,90.81 157.48,108.58 150.5,115.57 E40.33 147.32,116.84 144.78,116.84 141.6,120.02 141.6,121.28 D40TOP.18
MQ5
  Top 0.381: T60.B 162.24,19.37 153.03,19.37 153.03,22.86 138.43,37.47 138.43,104.14 137.79,104.78 137.79,113.03 E40.26 137.16,113.67 135.89,114.94 135.89,120.65 136.53,121.28 D40BOT.15
MQ6
  Bottom 0.381: T61.B 178.75,19.37 189.55,19.37 189.55,29.53 187.32,31.75 184.15,31.75 180.97,34.92 180.97,41.27 189.87,50.16 189.87,67.31 203.52,80.96 203.52,90.81 205.1,92.39 205.1,97.16 203.84,98.42 203.84,111.76 204.47,112.39 204.47,113.67 205.74,114.94 F40.9 205.74,120.65 206.38,121.28 E40TOP.5
MQ7
  Top 0.381: T62.B 190.82,19.37 189.55,20.64 189.55,29.53 187.32,31.75 184.15,31.75 180.97,34.92 180.97,41.27 184.15,44.45 184.15,106.68 190.5,113.03 F40.2 195.58,113.67 196.85,114.94 196.85,118.11 200.03,121.28 E40BOT.1
MQ8
  Bottom 0.381: T63.B 207.33,19.37 214.95,26.99 214.95,89.85 216.53,91.44 216.53,106.68 222.25,112.39 222.25,113.67 223.52,114.94 F40.23 223.52,116.2 219.71,120.02 219.71,120.65 219.07,121.28 E40TOP.13
MQ9
  Top 0.381: T64.B 219.39,19.37 213.68,25.08 213.68,40.96 203.52,51.12 203.52,90.81 205.1,92.39 205.1,97.16 203.84,98.42 203.84,107.95 208.28,112.39 F40.12 208.28,113.67 209.55,114.94 209.55,116.2 208.28,117.47 208.28,121.28 E40BOT.6
MQ10
  Bottom 0.381: T65.B 235.9,19.37 241.62,25.08 241.3,88.9 243.21,90.81 243.21,109.22 236.85,115.57 F40.33 236.22,120.02 227.33,120.02 227.33,121.28 E40TOP.18
MQ11
  Top 0.381: T66.B 247.97,19.37 240.35,19.37 237.17,22.54 234,25.72 226.06,25.72 F40.26 226.06,113.67 224.79,114.94 224.79,116.2 222.88,118.11 222.88,120.65 222.25,121.28 E40BOT.15
N$1
  Top 0.381: T1.C 5.4,101.92 DF0.B
N$2
  Top 0.381: T2.C 19.68,101.92 DF1.B
N$3
  Top 0.381: T3.C 33.97,101.92 DF2.B
N$4
  Top 0.381: T4.C 48.26,101.92 IF0.B
N$5
  Top 0.381: T5.C 62.55,101.92 IF1.B
N$6
  Top 0.381: T6.C 76.83,101.92 IF2.B
N$7
  Top 0.381: T7.C 91.12,101.92 PC0.B
N$8
  Top 0.381: T8.C 105.41,101.92 PC1.B
N$9
  Top 0.381: T9.C 119.7,101.92 PC2.B
N$10
  Top 0.381: T10.C 133.99,101.92 PC3.B
N$11
  Top 0.381: T11.C 148.27,101.92 PC4.B
N$12
  Top 0.381: T12.C 162.56,101.92 PC5.B
N$13
  Top 0.381: T13.C 176.85,101.92 PC6.B
N$14
  Top 0.381: T14.C 191.13,101.92 PC7.B
N$15
  Top 0.381: T15.C 205.42,101.92 PC8.B
N$16
  Top 0.381: T16.C 219.71,101.92 PC9.B
N$17
  Top 0.381: T17.C 234,101.92 PC10.B
N$18
  Top 0.381: T18.C 248.28,101.92 PC11.B
N$19
  Top 0.381: T19.C 91.76,82.87 91.76,79.69 MA0.B
N$20
  Top 0.381: MA1.B T20.C
N$21
  Top 0.381: T21.C 120.33,82.87 120.33,79.69 MA2.B
N$22
  Top 0.381: MA3.B T22.C
N$23
  Top 0.381: T23.C 148.91,82.87 148.91,79.69 MA4.B
N$24
  Top 0.381: MA5.B T24.C
N$25
  Top 0.381: T25.C 177.48,82.87 177.48,79.69 MA6.B
N$26
  Top 0.381: MA7.B T26.C
N$27
  Top 0.381: T27.C 206.06,82.87 206.06,79.69 MA8.B
N$28
  Top 0.381: MA9.B T28.C
N$29
  Top 0.381: T29.C 234.63,82.87 234.63,79.69 MA10.B
N$30
  Top 0.381: MA11.B T30.C
N$31
  Top 0.381: T31.C 91.76,60.64 91.76,57.47 MB0.B
N$32
  Top 0.381: MB1.B T32.C
N$33
  Top 0.381: T33.C 120.33,60.64 120.33,57.47 MB2.B
N$34
  Top 0.381: MB3.B T34.C
N$35
  Top 0.381: T35.C 148.91,60.64 148.91,57.47 MB4.B
N$36
  Top 0.381: MB5.B T36.C
N$37
  Top 0.381: T37.C 177.48,60.64 177.48,57.47 MB6.B
N$38
  Top 0.381: MB7.B T38.C
N$39
  Top 0.381: T39.C 206.06,60.64 206.06,57.47 MB8.B
N$40
  Top 0.381: MB9.B T40.C
N$41
  Top 0.381: T41.C 234.63,60.64 234.63,57.47 MB10.B
N$42
  Top 0.381: MB11.B T42.C
N$43
  Top 0.381: T43.C 91.76,38.42 91.76,35.24 AC0.B
N$44
  Top 0.381: AC1.B T44.C
N$45
  Top 0.381: T45.C 120.33,38.42 120.33,35.24 AC2.B
N$46
  Top 0.381: AC3.B T46.C
N$47
  Top 0.381: T47.C 148.91,38.42 148.91,35.24 AC4.B
N$48
  Top 0.381: AC5.B T48.C
N$49
  Top 0.381: T49.C 177.48,38.42 177.48,35.24 AC6.B
N$50
  Top 0.381: AC7.B T50.C
N$51
  Top 0.381: T51.C 206.06,38.42 206.06,35.24 AC8.B
N$52
  Top 0.381: AC9.B T52.C
N$53
  Top 0.381: T53.C 234.63,38.42 234.63,35.24 AC10.B
N$54
  Top 0.381: AC11.B T54.C
N$55
  Top 0.381: T55.C 91.76,16.19 91.76,13.02 MQ0.B
N$56
  Top 0.381: MQ1.B T56.C
N$57
  Top 0.381: T57.C 120.33,16.19 120.33,13.02 MQ2.B
N$58
  Top 0.381: MQ3.B T58.C
N$59
  Top 0.381: T59.C 148.91,16.19 148.91,13.02 MQ4.B
N$60
  Top 0.381: MQ5.B T60.C
N$61
  Top 0.381: T61.C 177.48,16.19 177.48,13.02 MQ6.B
N$62
  Top 0.381: MQ7.B T62.C
N$63
  Top 0.381: T63.C 206.06,16.19 206.06,13.02 MQ8.B
N$64
  Top 0.381: MQ9.B T64.C
N$65
  Top 0.381: T65.C 234.63,16.19 234.63,13.02 MQ10.B
N$66
  Top 0.381: MQ11.B T66.C
N$67
  Top 0.381: T67.C 6.35,16.19 6.35,13.02 SC0.B
N$68
  Top 0.381: T68.C 20.32,16.19 20.32,13.02 SC1.B
N$69
  Top 0.381: T69.C 34.92,16.19 34.92,13.02 SC2.B
N$70
  Top 0.381: T70.C 48.9,16.19 48.9,13.02 SC3.B
N$71
  Top 0.381: T71.C 63.5,16.19 63.5,13.02 SC4.B
N$72
  Top 0.381: LINK.B T72.C
N$73
  Top 0.381: T73.C 356.55,98.11 358.46,98.11 361.31,100.97 ION.B
N$74
  Top 0.381: PAUSE.B 361.63,87.95 361.63,86.68 356.55,86.68 T74.C
N$75
  Top 0.381: T75.C 356.55,75.88 361.63,75.88 361.63,77.15 362.9,78.42 RUN.B
N$76
  Top 0.381: T76.C 341.95,98.11 338.14,98.11 335.6,100.65 FETCH.B
N$77
  Top 0.381: EXECUTE.B 338.14,86.68 341.95,86.68 T77.C
N$78
  Top 0.381: T78.C 338.77,75.25 335.6,78.42 DEFER.B
N$79
  Top 0.381: WORDCOUNT.B 338.14,64.45 341.95,64.45 T79.C
N$80
  Top 0.381: T80.C 341.95,53.66 338.14,53.66 335.6,56.2 CURRENTADDRESS.B
N$81
  Top 0.381: BREAK.B 338.14,42.23 341.95,42.23 T81.C
N$82
  Top 0.381: T82.C 313.37,98.11 308.29,98.11 308.29,99.38 307.02,100.65 AND.B
N$83
  Top 0.381: TAD.B 308.29,87.95 308.29,86.68 313.37,86.68 T83.C
N$84
  Top 0.381: T84.C 313.37,75.88 308.29,75.88 308.29,77.15 307.02,78.42 ISZ.B
N$85
  Top 0.381: DCA.B 308.29,65.72 308.29,64.45 313.37,64.45 T85.C
N$86
  Top 0.381: T86.C 313.37,53.66 308.29,53.66 308.29,54.93 307.02,56.2 JMS.B
N$87
  Top 0.381: JMP.B 308.29,43.5 308.29,42.23 313.37,42.23 T87.C
N$88
  Top 0.381: T88.C 313.37,31.43 308.29,31.43 308.29,32.7 307.02,33.97 IOT.B
N$89
  Top 0.381: OPR.B 308.29,21.27 308.29,20 313.37,20 T89.C
N$90
  Top 0.381: R1.2 7.62,93.98 7.62,95.89 DF0.A
N$91
  Top 0.381: R2.2 22.23,93.98 22.23,95.89 DF1.A
N$92
  Top 0.381: R3.2 36.2,93.98 36.2,95.89 DF2.A
N$93
  Top 0.381: R4.2 50.8,95.89 IF0.A
N$94
  Top 0.381: R5.2 64.77,93.98 64.77,95.89 IF1.A
N$95
  Top 0.381: R6.2 79.38,95.89 IF2.A
N$96
  Top 0.381: R7.2 93.34,93.98 93.34,95.89 PC0.A
N$97
  Top 0.381: R8.2 107.95,95.89 PC1.A
N$98
  Top 0.381: R9.2 121.92,93.98 121.92,97.47 PC2.A
N$99
  Top 0.381: R10.2 136.53,95.89 PC3.A
N$100
  Top 0.381: R11.2 150.5,93.98 150.5,95.89 PC4.A
N$101
  Top 0.381: R12.2 168.28,98.42 PC5.A
N$102
  Top 0.381: R13.2 179.07,93.98 179.07,95.89 PC6.A
N$103
  Top 0.381: R14.2 193.68,95.89 PC7.A
N$104
  Top 0.381: R15.2 207.65,93.98 207.65,95.89 PC8.A
N$105
  Top 0.381: R16.2 222.25,95.89 PC9.A
N$106
  Top 0.381: R17.2 236.22,93.98 236.22,95.89 PC10.A
N$107
  Top 0.381: R18.2 250.82,95.89 PC11.A
N$108
  Top 0.381: ION.A 363.54,95.57 R73.2
N$109
  Top 0.381: R74.2 PAUSE.A
N$110
  Top 0.381: R75.2 RUN.A
N$111
  Top 0.381: R19.2 91.76,73.34 91.76,75.25 MA0.A
N$112
  Top 0.381: R20.2 MA1.A
N$113
  Top 0.381: R21.2 120.33,73.34 120.33,75.25 MA2.A
N$114
  Top 0.381: R22.2 MA3.A
N$115
  Top 0.381: R23.2 148.91,73.34 148.91,75.25 MA4.A
N$116
  Top 0.381: R24.2 167.96,75.88 164.15,75.88 MA5.A
N$117
  Top 0.381: R25.2 177.48,73.34 177.48,75.25 MA6.A
N$118
  Top 0.381: R26.2 MA7.A
N$119
  Top 0.381: R27.2 206.06,73.34 206.06,75.25 MA8.A
N$120
  Top 0.381: R28.2 MA9.A
N$121
  Top 0.381: R29.2 234.63,73.34 234.63,75.25 MA10.A
N$122
  Top 0.381: R30.2 MA11.A
N$123
  Top 0.381: R76.2 FETCH.A
N$124
  Top 0.381: R77.2 EXECUTE.A
N$125
  Top 0.381: R78.2 DEFER.A
N$126
  Top 0.381: R79.2 WORDCOUNT.A
N$127
  Top 0.381: R80.2 CURRENTADDRESS.A
N$128
  Top 0.381: R81.2 BREAK.A
N$129
  Top 0.381: R72.2 LINK.A
N$130
  Top 0.381: R31.2 91.76,51.12 91.76,53.02 MB0.A
N$131
  Top 0.381: R32.2 MB1.A
N$132
  Top 0.381: R33.2 120.33,51.12 120.33,53.02 MB2.A
N$133
  Top 0.381: R34.2 MB3.A
N$134
  Top 0.381: R35.2 148.91,51.12 148.91,53.02 MB4.A
N$135
  Top 0.381: R36.2 167.96,53.66 164.15,53.66 MB5.A
N$136
  Top 0.381: R37.2 177.48,51.12 177.48,53.02 MB6.A
N$137
  Top 0.381: R38.2 MB7.A
N$138
  Top 0.381: R39.2 206.06,51.12 206.06,53.02 MB8.A
N$139
  Top 0.381: R40.2 MB9.A
N$140
  Top 0.381: R41.2 234.63,51.12 234.63,53.02 MB10.A
N$141
  Top 0.381: R42.2 MB11.A
N$142
  Top 0.381: R43.2 91.76,28.89 91.76,30.8 AC0.A
N$143
  Top 0.381: R44.2 AC1.A
N$144
  Top 0.381: R45.2 120.33,28.89 120.33,30.8 AC2.A
N$145
  Top 0.381: R46.2 AC3.A
N$146
  Top 0.381: R47.2 148.91,28.89 148.91,30.8 AC4.A
N$147
  Top 0.381: R48.2 167.96,31.43 164.15,31.43 AC5.A
N$148
  Top 0.381: R49.2 177.48,28.89 177.48,30.8 AC6.A
N$149
  Top 0.381: R50.2 AC7.A
N$150
  Top 0.381: R51.2 206.06,28.89 206.06,30.8 AC8.A
N$151
  Top 0.381: R52.2 AC9.A
N$152
  Top 0.381: R53.2 234.63,28.89 234.63,30.8 AC10.A
N$153
  Top 0.381: R54.2 AC11.A
N$154
  Top 0.381: R67.2 6.35,6.67 6.35,8.57 SC0.A
N$155
  Top 0.381: R68.2 20.32,6.67 20.32,8.57 SC1.A
N$156
  Top 0.381: R69.2 34.92,6.67 34.92,8.57 SC2.A
N$157
  Top 0.381: R70.2 48.9,6.67 48.9,8.57 SC3.A
N$158
  Top 0.381: R71.2 63.5,6.67 63.5,8.57 SC4.A
N$159
  Top 0.381: MQ11.A R66.2
N$160
  Top 0.381: R65.2 234.63,6.67 234.63,8.57 MQ10.A
N$161
  Top 0.381: R64.2 MQ9.A
N$162
  Top 0.381: R63.2 206.06,6.67 206.06,8.57 MQ8.A
N$163
  Top 0.381: R62.2 MQ7.A
N$164
  Top 0.381: R61.2 177.48,6.67 177.48,8.57 MQ6.A
N$165
  Top 0.381: R60.2 169.23,4.76 164.15,9.84 MQ5.A
N$166
  Top 0.381: R59.2 148.91,6.67 148.91,8.57 MQ4.A
N$167
  Top 0.381: R58.2 MQ3.A
N$168
  Top 0.381: R57.2 120.33,6.67 120.33,8.57 MQ2.A
N$169
  Top 0.381: R56.2 MQ1.A
N$170
  Top 0.381: R55.2 91.76,6.67 91.76,8.57 MQ0.A
N$171
  Top 0.381: R82.2 AND.A
N$172
  Top 0.381: R83.2 TAD.A
N$173
  Top 0.381: R84.2 ISZ.A
N$174
  Top 0.381: R85.2 DCA.A
N$175
  Top 0.381: R86.2 JMS.A
N$176
  Top 0.381: R87.2 JMP.A
N$177
  Top 0.381: R88.2 IOT.A
N$178
  Top 0.381: R89.2 OPR.A
OPR
  Top 0.381: T89.B 315.28,22.54 326.07,33.34 327.66,112.39 D40.16 327.66,113.67 328.93,114.94 328.93,116.2 330.2,117.47 330.2,121.28 F40BOT.11
PAUSE
  Top 0.381: T74.B 354.65,89.22 350.2,93.66 350.2,103.82 349.25,104.78 349.25,113.67 347.98,114.94 D40.31
  Bottom 0.381: F40TOP.17 339.73,120.65 340.36,120.02 343.54,116.84 347.98,116.84 D40.31
PC0
  Top 0.381: T7.B 93.98,107.31 102.23,115.57 106.05,115.57 E40.1
  Bottom 0.381: D40TOP.1 114.3,121.28 106.68,121.28 106.68,116.2 E40.1
PC1
  Top 0.381: T8.B 108.58,107.31 111.76,110.49 116.2,110.49 116.2,113.03 E40.10 116.84,113.67 118.11,114.94 118.11,116.2 120.02,118.11 120.02,120.65 120.65,121.28 D40BOT.5
PC2
  Top 0.381: T9.B 121.92,107.31 118.11,111.12 118.11,113.67 119.38,114.94 E40.11
  Bottom 0.381: D40TOP.6 121.92,121.28 121.92,118.75 119.38,116.2 E40.11
PC3
  Top 0.381: D40BOT.14 134.62,121.28 134.62,117.47 133.35,116.2 133.35,114.94 134.62,113.67 E40.24 134.62,112.39 134.62,108.58 135.89,107.31 T10.B
PC4
  Bottom 0.381: T11.B 150.5,107.31 149.22,108.58 138.43,108.58 138.43,113.67 137.16,114.94 E40.25 137.16,116.2 135.25,118.11 135.25,121.28 D40TOP.14
PC5
  Top 0.381: 148.59,111.12 147.32,111.12 147.32,112.39 E40.34 | 148.59,111.12 160.66,111.12 164.47,107.31 T12.B | 148.59,111.12 148.59,121.28 142.88,121.28 D40BOT.19
PC6
  Top 0.381: T13.B 179.71,107.31 187.96,115.57 194.94,115.57 F40.1
  Bottom 0.381: E40TOP.1 200.03,121.28 195.58,116.84 195.58,116.2 F40.1
PC7
  Top 0.381: E40BOT.5 206.38,121.28 207.01,120.65 207.01,114.94 205.74,113.67 F40.10 205.74,112.39 202.25,108.9 202.25,104.14 195.58,104.14 194.31,105.41 T14.B
PC8
  Bottom 0.381: T15.B 208.28,107.31 209.55,108.58 209.55,113.67 208.28,114.94 F40.11 208.28,116.2 208.28,121.28 E40TOP.6
PC9
  Top 0.381: T16.B 222.88,107.31 223.52,107.95 223.52,112.39 F40.24 223.52,113.67 222.25,114.94 222.25,116.2 220.98,117.47 220.98,121.28 E40BOT.14
PC10
  Bottom 0.381: T17.B 236.22,107.31 234.95,108.58 227.33,108.58 227.33,113.67 226.06,114.94 F40.25 225.43,115.57 220.98,120.02 220.98,121.28 E40TOP.14
PC11
  Top 0.381: 237.49,113.03 236.85,113.03 F40.34 | 237.49,113.03 244.47,113.03 250.19,107.31 T18.B | 237.49,113.03 237.49,121.28 228.6,121.28 E40BOT.19
RUN
  Top 0.381: T75.B 356.55,78.42 361.63,78.42 361.63,80.33 365.44,84.14 365.44,101.92 351.79,115.57 D40.33
  Bottom 0.381: D40.33 350.52,118.11 343.54,118.11 341.31,120.33 341.31,121.6 F40TOP.18
SC0
  Top 0.381: T67.B 7.62,18.73 19.05,7.3 19.05,5.4 19.68,4.76 29.21,4.76 29.21,106.05 35.56,112.39 35.56,113.67 34.29,114.94 C40.9
  Bottom 0.381: C40TOP.5 34.92,121.28 34.29,120.65 34.29,116.2 C40.9
SC1
  Top 0.381: T68.B 21.59,19.37 24.13,21.91 24.13,101.6 20.95,104.78 20.95,109.22 24.13,112.39 C40.2 24.13,113.67 25.4,114.94 25.4,118.11 28.57,121.28 C40BOT.1
SC2
  Top 0.381: T69.B 36.2,18.73 47.62,7.3 47.62,5.4 48.26,4.76 54.61,4.76 54.61,111.12 53.34,112.39 53.34,113.67 52.07,114.94 C40.23
  Bottom 0.381: C40TOP.13 47.62,121.28 48.26,120.65 48.26,120.02 52.07,116.2 C40.23
SC3
  Top 0.381: 38.1,118.75 36.83,120.02 36.83,121.28 C40BOT.6 | 38.1,118.75 40.64,116.2 40.64,25.4 48.26,19.37 T70.B | 38.1,118.75 35.56,116.2 35.56,114.94 36.83,113.67 C40.12
SC4
  Top 0.381: T71.B 64.77,19.37 84.14,19.37 84.14,101.28 80.64,104.78 80.64,107.95 73.03,115.57 65.41,115.57 C40.33
  Bottom 0.381: C40TOP.18 55.88,121.28 55.88,120.02 59.05,116.84 64.77,116.84 64.77,116.2 C40.33
TAD
  Top 0.381: T83.B 315.28,89.22 316.55,90.49 316.55,106.68 313.69,109.54 312.42,110.81 D40.4 313.69,114.3 313.69,116.2 315.91,118.43 315.91,121.6 F40BOT.2
WC
  Top 0.381: T79.B 343.85,66.99 347.66,70.8 347.66,103.82 345.44,106.05 D40.30 345.44,113.67 344.17,114.94 344.17,116.2 340.36,120.02 339.73,120.65 F40BOT.17

## Text on the board
Bottom: PDP-8/I Light Board 50045108 | A | 5404519 | VRS